# Altium schematic sheet MB1297_USB_OTG_FS.SchDoc: USB_OTG_FS
size A4; DocumentNumber: MB1297; Revision: D; SheetNumber: 4; SheetTotal: 11
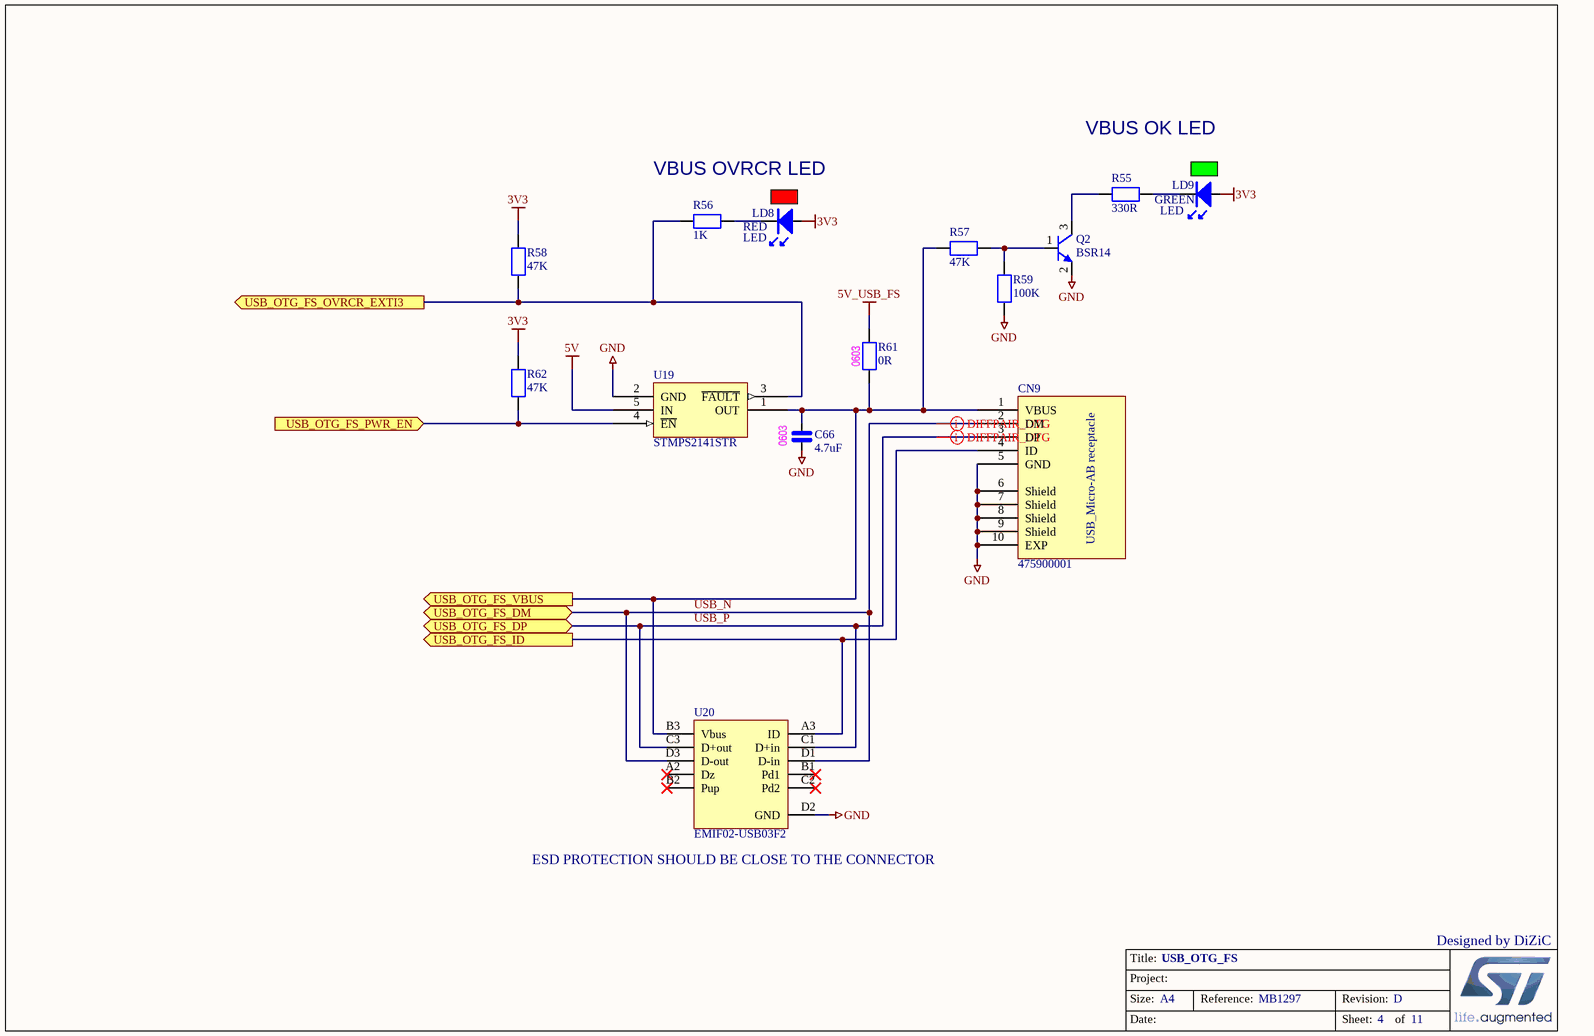
[diagram p0: MB1297_USB_OTG_FS.SchDoc]

## Parts
C66  4.7uF  [0603_CAP_NPOL]
CN9  475900001  [CON_USBMICROAB_MOLEX_47590-0001_H3]
LD8  LED  Color: RED  [0603_LED_RED]
LD9  LED  Color: GREEN  [0603_LED_GREEN]
Q2  BSR14  [SOT23-3]
R55  330R  [0402_RES]
R56  1K  [0402_RES]
R57  47K  [0402_RES]
R58  47K  [0402_RES]
R59  100K  [0402_RES]
R61  0R  [0603_RES]
R62  47K  [0402_RES]
U19  STMPS2141STR  [MOS_SOT23-5L]
U20  EMIF02-USB03F2  [ESD_FLIP-CHIP-BGA11_1P44X1P94_P050]

## Ports
USB_OTG_FS_DM (bidir), USB_OTG_FS_DP (bidir), USB_OTG_FS_ID (out), USB_OTG_FS_OVRCR_EXTI3 (out), USB_OTG_FS_PWR_EN (in), USB_OTG_FS_VBUS (out)

## Nets
3V3: LD8.A LD9.A R58.1 R62.1
5V: U19.5(IN)
5V_USB_FS: R61.1
GND: C66.2 CN9.5(GND) CN9.6(Shield) CN9.7(Shield) CN9.8(Shield) CN9.9(Shield) CN9.10(EXP) Q2.2(E) R59.1 U19.2(GND) U20.D2(GND)
USB_N: CN9.2(DM) U20.D1(D-in) U20.D3(D-out) ; port USB_OTG_FS_DM
USB_OTG_FS_ID: CN9.4(ID) U20.A3(ID) ; port USB_OTG_FS_ID
USB_OTG_FS_OVRCR_EXTI3: R56.1 R58.2 U19.3(~{FAULT}) ; port USB_OTG_FS_OVRCR_EXTI3
USB_OTG_FS_PWR_EN: R62.2 U19.4(~{EN}) ; port USB_OTG_FS_PWR_EN
USB_OTG_FS_VBUS: C66.1 CN9.1(VBUS) R57.1 R61.2 U19.1(OUT) U20.B3(Vbus) ; port USB_OTG_FS_VBUS
USB_P: CN9.3(DP) U20.C1(D+in) U20.C3(D+out) ; port USB_OTG_FS_DP
NetLD8_K: LD8.K R56.2
NetLD9_K: LD9.K R55.2
NetQ2_1: Q2.1(B) R57.2 R59.2
NetQ2_3: Q2.3(C) R55.1

Not connected (* = marked no-connect by the designer): U20 A2(Dz)* B1(Pd1)* B2(Pup)* C2(Pd2)*

## Layout directives
differential pair: USB_N, USB_P

## Notes on the sheet
- VBUS OVRCR LED
- VBUS OK LED
- (near R61) 0603
- (near C66) 0603
- (near U20) ESD PROTECTION SHOULD BE CLOSE TO THE CONNECTOR
- Designed by DiZiC
- Title:
- Project:
- Size:
- Date:
- A4
- Reference:
- Sheet:
- Revision:
- of
- (in symbol 475900001) USB_Micro-AB receptacle

## Library data of the parts
C66 = CAP_NPOL: Capacitor_not polarized
CN9 = 475900001: USB-MICRO-AB, 47590-0001, SMT, MOLEX; Fitted: YES; Ordered_By: Subcon; Manuf_Part_1: 47590-0001; Manuf_1: MOLEX; ECCN_US/EU: n/a; Distrib: *; Value: 475900001; Order_Code: *
LD8 LD9 = LED: Light-Emitting Diode; Part Number A: *
Q2 = BSR14: BSR14 NPN switching transistor SOT23 (Marking U8)
R55-R59 R61 R62 = RES: Resistor
U19 = STMPS2141STR: Enhanced single channel power switches; Manuf_1: STM; ECCN_US/EU: EAR99/NEC; Ref St: 9159003; Fitted: YES; Manuf_Part_1: STMPS2141STR; Distrib: STM; Ordered_By: STM; Order_Code: STMPS2141STR; Value: STMPS2141STR
U20 = EMIF02-USB03F2: 2-line IPAD, EMI filter including ESD protection; Manuf_1: STM; ECCN_US/EU: EAR99/NEC; Fitted: YES; REF_STM: 9179037; Manuf_Part_1: EMIF02-USB03F2; Distrib: ST; Order_code: EMIF02-USB03F2; Ordered_By: STM; Value: EMIF02-USB03F2